# EAGLE design PasurV3 (EAGLE 9.1.1)
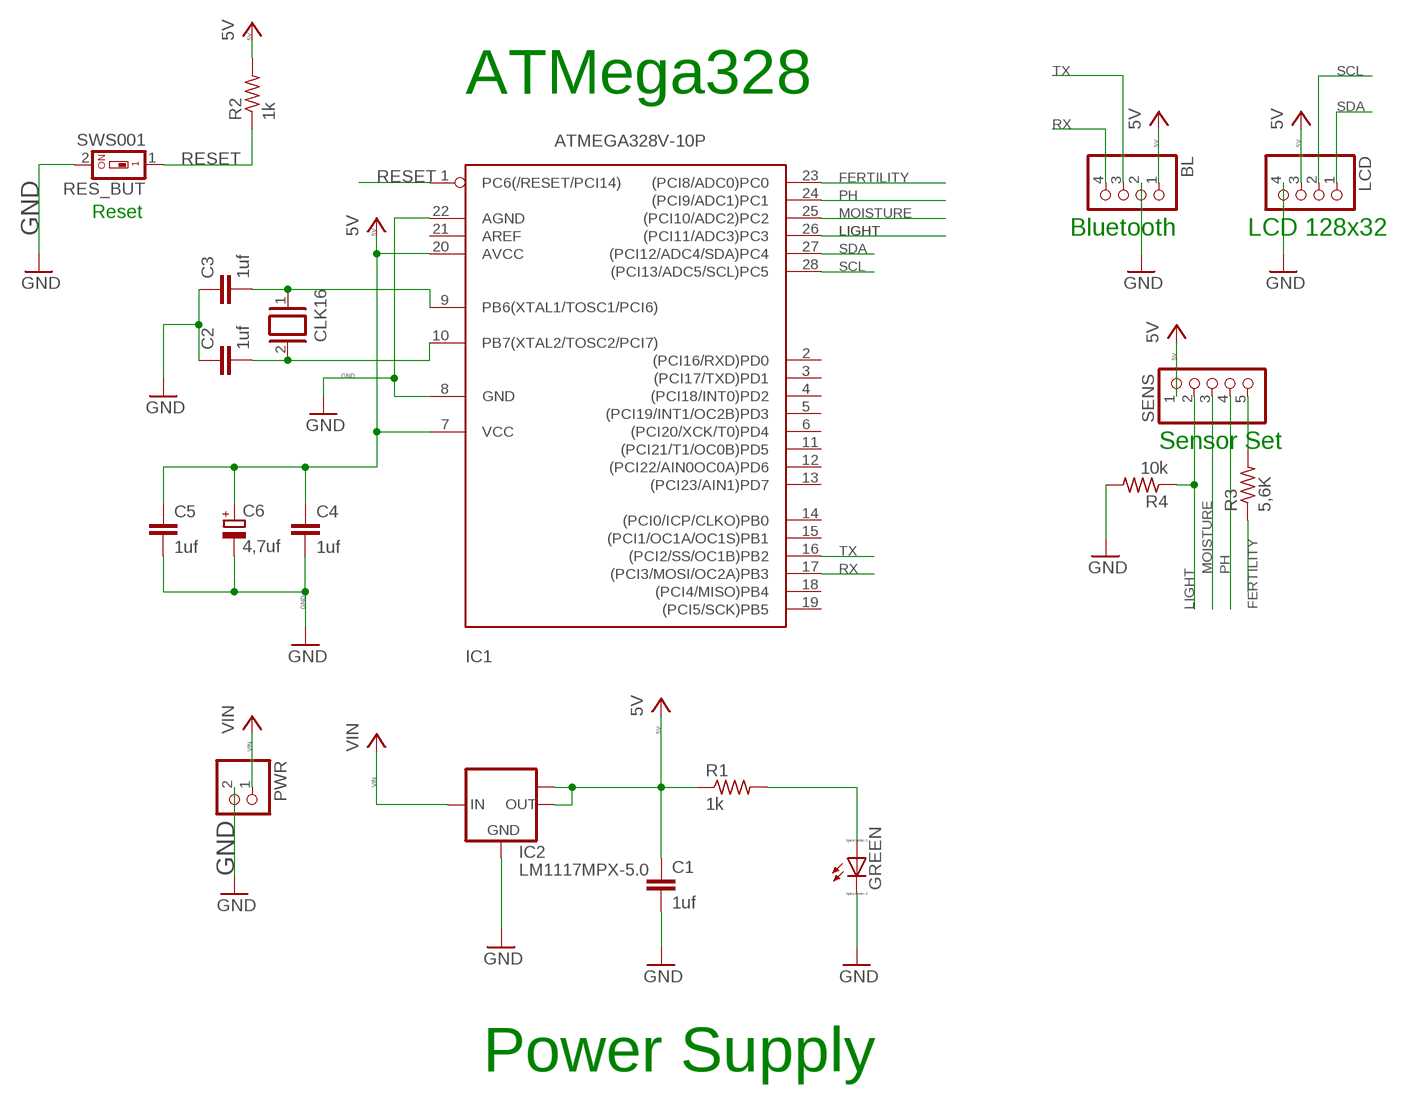
[diagram p0: schematic, sheet 1]

## Parts
BL  PINHD-1X4  [1X04]
C1  1uf  C-EUC1206  [C1206]
C2  1uf  C-EUC1206  [C1206]
C3  1uf  C-EUC1206  [C1206]
C4  1uf  C-EUC1206  [C1206]
C5  1uf  C-EUC1206  [C1206]
C6  4,7uf  CPOL-EUA/3216-18W  [A/3216-18W]
CLK16  XTAL/S  [QS]
GREEN  LED_E  [LED_1206]
IC1  ATMEGA328V-10P  [DIL28-3]
IC2  LM1117MPX-5.0  [SOT223]
LCD  PINHD-1X4  [1X04]
PWR  PINHD-1X2  [1X02]
R1  1k  R-US_M1206  [M1206]
R2  1k  R-US_M1206  [M1206]
R3  5,6K  R-US_M1206  [M1206]
R4  10k  R-US_M1206  [M1206]
RES_BUT  SWS001  [SMS-001]
SENS  PINHD-1X5  [1X05]

## Nets
5V: BL.1 C1.1 C4.1 C5.1 C6.+ IC1.7(VCC) IC1.20(AVCC) IC2.2(OUT) IC2.TAB(OUT1) LCD.3 R1.1 R2.2 SENS.1
FERTILITY: IC1.23((PCI8/ADC0)PC0) R3.1
GND: BL.2 C1.2 C2.1 C3.1 C4.2 C5.2 C6.- GREEN.C IC1.8(GND) IC1.22(AGND) IC2.1(GND) LCD.4 PWR.2 R4.2 RES_BUT.2
LIGHT: IC1.26((PCI11/ADC3)PC3) R4.1 SENS.2
MOISTURE: IC1.25((PCI10/ADC2)PC2) SENS.3
N$1: C3.2 CLK16.1 IC1.9(PB6(XTAL1/TOSC1/PCI6))
N$2: C2.2 CLK16.2 IC1.10(PB7(XTAL2/TOSC2/PCI7))
N$3: GREEN.A R1.2
N$11: R3.2 SENS.5
PH: IC1.24((PCI9/ADC1)PC1) SENS.4
RESET: IC1.1(PC6(/RESET/PCI14)) R2.1 RES_BUT.1
RX: BL.4 IC1.17((PCI3/MOSI/OC2A)PB3)
SCL: IC1.28((PCI13/ADC5/SCL)PC5) LCD.2
SDA: IC1.27((PCI12/ADC4/SDA)PC4) LCD.1
TX: BL.3 IC1.16((PCI2/SS/OC1B)PB2)
VIN: IC2.3(IN) PWR.1
Unconnected: IC1.2((PCI16/RXD)PD0) IC1.3((PCI17/TXD)PD1) IC1.4((PCI18/INT0)PD2) IC1.5((PCI19/INT1/OC2B)PD3) IC1.6((PCI20/XCK/T0)PD4) IC1.11((PCI21/T1/OC0B)PD5) IC1.12((PCI22/AIN0OC0A)PD6) IC1.13((PCI23/AIN1)PD7) IC1.14((PCI0/ICP/CLKO)PB0) IC1.15((PCI1/OC1A/OC1S)PB1) IC1.18((PCI4/MISO)PB4) IC1.19((PCI5/SCK)PB5) IC1.21(AREF)

## Notes on the sheet
- ATMega328
- Reset
- Bluetooth | LCD 128x32
- Sensor Set
- Power Supply

## Library data of the parts
BL LCD = pinhead:PINHD-1X4: PIN HEADER
C1-C5 = resistor:C-EU: CAPACITOR, European symbol
C6 = rcl:CPOL-EU: POLARIZED CAPACITOR, European symbol; SPICEPREFIX: C
CLK16 = special:XTAL/S: CRYSTAL
GREEN = eagle-ltspice:LED_E: LED Source: http://www.osram.convergy.de Source: www.luxeon.com Source: www.kingbright.com; SPICEMODEL: NONE; SPICEPREFIX: D; SPICETYPE: diode
IC1 = atmega328:ATMEGA328*P: MICROCONTROLLER 32 kBytes FLASH 2 kBytes SRAM 1 kBytes EEPROM USART 8-channel 10 bit ADC
IC2 = lm1117:LM1117MPX-*
PWR = pinhead:PINHD-1X2: PIN HEADER
R1-R4 = resistor:R-US_: RESISTOR, American symbol
RES_BUT = smd-special:SWS001: SMD Dip Switch 1 pol.
SENS = pinhead:PINHD-1X5: PIN HEADER

## Board
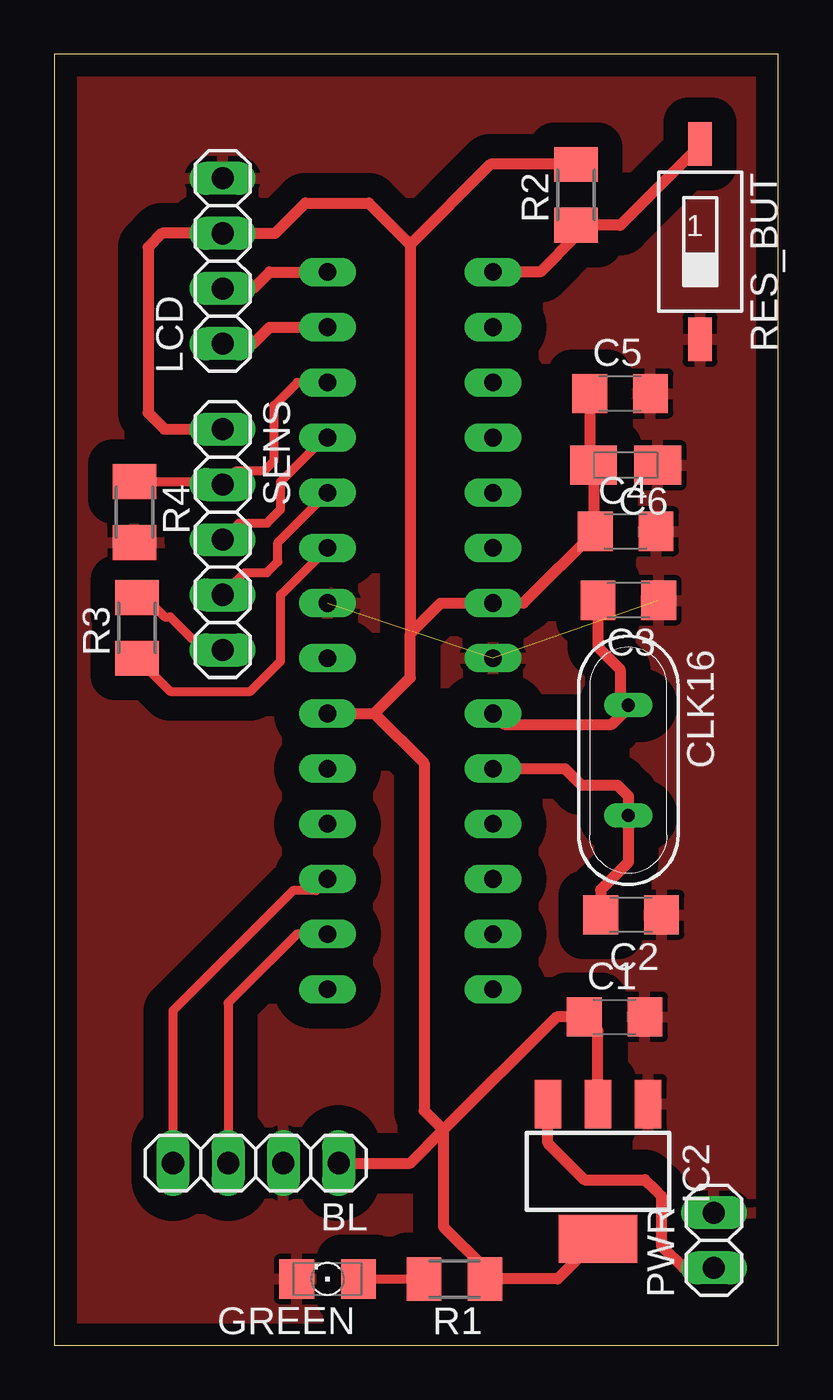
[diagram p1: board, top side]
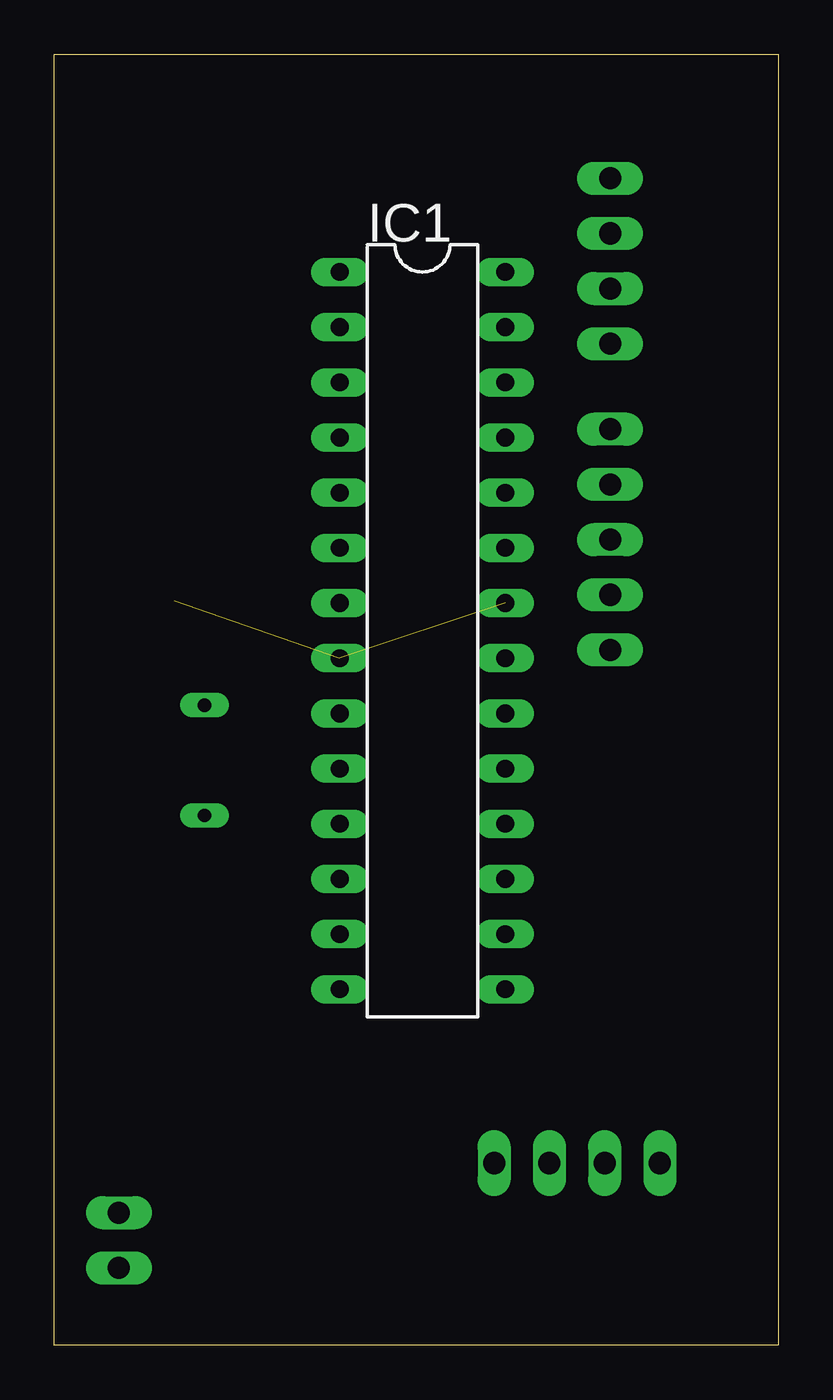
[diagram p2: board, bottom side, seen from below]

Size 33.33 x 59.43 mm. Coordinates in mm from the lower left corner, seen from the top.
Outline: 0,0 33.33,0 33.33,59.43 0,59.43 0,0
Copper layers (1*16): Top 0.035mm / dielectric 1.5mm / Bottom 0.035mm
Design rules "default *": minimum track width 6mil, minimum drill 0.35mm, track to track 45mil, track to pad 45mil, pad to pad 6mil, via to via 6mil, smd to smd 6mil, copper to edge 40mil, drill to drill 6mil, minimum pad ring 10mil, minimum via ring 8mil, stop-mask expansion 4mil, vias tented up to drill 0mil, thermal gap 10mil

### Footprints (pad centres in the part's own frame; a part is rotated, then mirrored left to right if it is on the bottom)
1X04 = drill 1.016 long: 1 -3.81,0; 2 -1.27,0; 3 1.27,0; 4 3.81,0
C1206 = smd 1.6 x 1.8: 1 -1.4,0; 2 1.4,0
A/3216-18W = smd 2.15 x 1.8: + 1.475,0; - -1.475,0
QS = drill 0.61 long: 1 -2.54,0; 2 2.54,0
LED_1206 = smd 1.6 x 1.803: A -1.422,0; C 1.422,0
DIL28-3 = drill 0.813 long: 1 -16.51,-3.81; 2 -13.97,-3.81; 3 -11.43,-3.81; 4 -8.89,-3.81; 5 -6.35,-3.81; 6 -3.81,-3.81; 7 -1.27,-3.81; 8 1.27,-3.81; 9 3.81,-3.81; 10 6.35,-3.81; 11 8.89,-3.81; 12 11.43,-3.81; 13 13.97,-3.81; 14 16.51,-3.81; 15 16.51,3.81; 16 13.97,3.81; 17 11.43,3.81; 18 8.89,3.81; 19 6.35,3.81; 20 3.81,3.81; 21 1.27,3.81; 22 -1.27,3.81; 23 -3.81,3.81; 24 -6.35,3.81; 25 -8.89,3.81; 26 -11.43,3.81; 27 -13.97,3.81; 28 -16.51,3.81
SOT223 = smd 1.219 x 2.235: 1 -2.311,-3.099; 2 0,-3.099; 3 2.311,-3.099 | smd 3.6 x 2.2: TAB 0,3.099
1X02 = drill 1.016 long: 1 -1.27,0; 2 1.27,0
M1206 = smd 1.6 x 2: 1 -1.4,0; 2 1.4,0
SMS-001 = smd 1.092 x 2.007: 1 0,-4.496; 2 0,4.496
1X05 = drill 1.016 long: 1 -5.08,0; 2 -2.54,0; 3 0,0; 4 2.54,0; 5 5.08,0

### Placement (x,y rotation side)
BL  9.27,8.38 180 top
C1  25.78,15.11 0 top
C2  26.54,19.81 180 top
C3  26.42,34.29 180 top
C4  26.29,37.47 0 top
C5  26.04,43.81 0 top
C6  26.29,40.51 180 top
CLK16  26.42,26.92 270 top
GREEN  12.57,3.05 180 top
IC1  16.38,32.89 270 bottom
IC2  25.02,8 180 top
LCD  7.75,49.91 90 top
PWR  30.35,4.83 90 top
R1  18.41,3.05 180 top
R2  24,52.96 90 top
R3  3.81,33.02 90 top
R4  3.68,38.35 270 top
RES_BUT  29.72,50.8 180 top
SENS  7.75,37.08 270 top

### Tracks (layer width: path | path; a pad name or v marks a point on that pad's centre or on a via)
5V
  Top 0.508: C1.1 | IC2.TAB 23.16,3.05 R1.1 19.82,3.55 17.91,5.46 17.91,9.91 | IC2.2 25.02,14.47 C1.1 | C1.1 23.11,15.11 17.91,9.91 | IC1.20 14.73,29.08 | 14.73,29.08 17.02,26.8 17.02,10.79 17.91,9.91 | 16.38,32.77 16.38,30.73 14.73,29.08 | 16.38,32.77 17.78,34.16 IC1.7 21.59,34.16 C4.1 24.81,37.54 C6.+ 24.64,40.69 C5.1 | SENS.1 5.08,42.16 4.32,42.93 4.32,50.55 4.95,51.18 LCD.3 10.16,51.18 11.56,52.58 14.48,52.58 16.38,50.67 | 16.38,50.67 16.38,32.77 | R2.2 20.07,54.36 16.38,50.67 | BL.1 16.38,8.38 17.91,9.91
FERTILITY
  Top 0.406: R3.1 5.33,30.1 9.02,30.1 10.41,31.5 10.41,34.54 IC1.23
GND  (2 unrouted)
  pour Top: 1.14,58.55 32.51,58.55 33.15,57.91 33.15,0.51 1.78,0.51 1.14,1.14
LIGHT
  Top 0.406: 3.55,39.62 R4.1 7.62,39.75 SENS.2 8.38,40.26 9.65,40.26 10.11,40.72 10.11,43.26 11.18,44.32 IC1.26
MOISTURE
  Top 0.406: SENS.3 8.51,37.85 9.78,37.85 10.41,38.48 10.41,39.75 12.45,41.78 IC1.25
N$1
  Top 0.406: 26.42,29.34 CLK16.1
  Top 0.508: C3.2 25.02,32.13 26.04,31.12 26.04,29.84 CLK16.1 | IC1.9 20.7,28.57 25.65,28.57 26.42,29.34
N$2
  Top 0.406: CLK16.2 26.54,24.38
  Top 0.508: C2.2 25.14,20.95 26.42,22.23 CLK16.2 26.42,25.27 25.91,25.78 24.26,25.78 23.5,26.54 IC1.10
N$3
  Top 0.406: GREEN.A 16.97,3.05 16.99,3.03
  Top 0.508: 16.99,3.03 R1.2
N$11
  Top 0.406: SENS.5 6.86,32 5.33,33.53 5.08,33.53 4.19,34.42 R3.2
PH
  Top 0.406: SENS.4 8.76,35.56 9.78,35.56 10.29,36.07 10.29,36.96 IC1.24
RESET
  Top 0.508: IC1.1 22.35,49.4 24,51.05 R2.1 26.03,51.56 29.72,55.24 RES_BUT.1
RX
  Top 0.406: IC1.17 12.04,20.93 10.99,20.93 5.46,15.4 BL.4
SCL
  Top 0.508: LCD.2 9.14,48.64 9.91,49.4 IC1.28
SDA
  Top 0.508: LCD.1 9.14,46.1 9.91,46.86 IC1.27
TX
  Top 0.406: IC1.16 11.18,18.92 8,15.75 BL.3
VIN
  Top 0.508: IC2.3 22.71,9.3 24.38,7.62 27.18,7.62 27.62,7.18 | 27.62,7.18 | 27.62,7.18 27.94,6.86 27.94,4.57 28.96,3.56 PWR.1